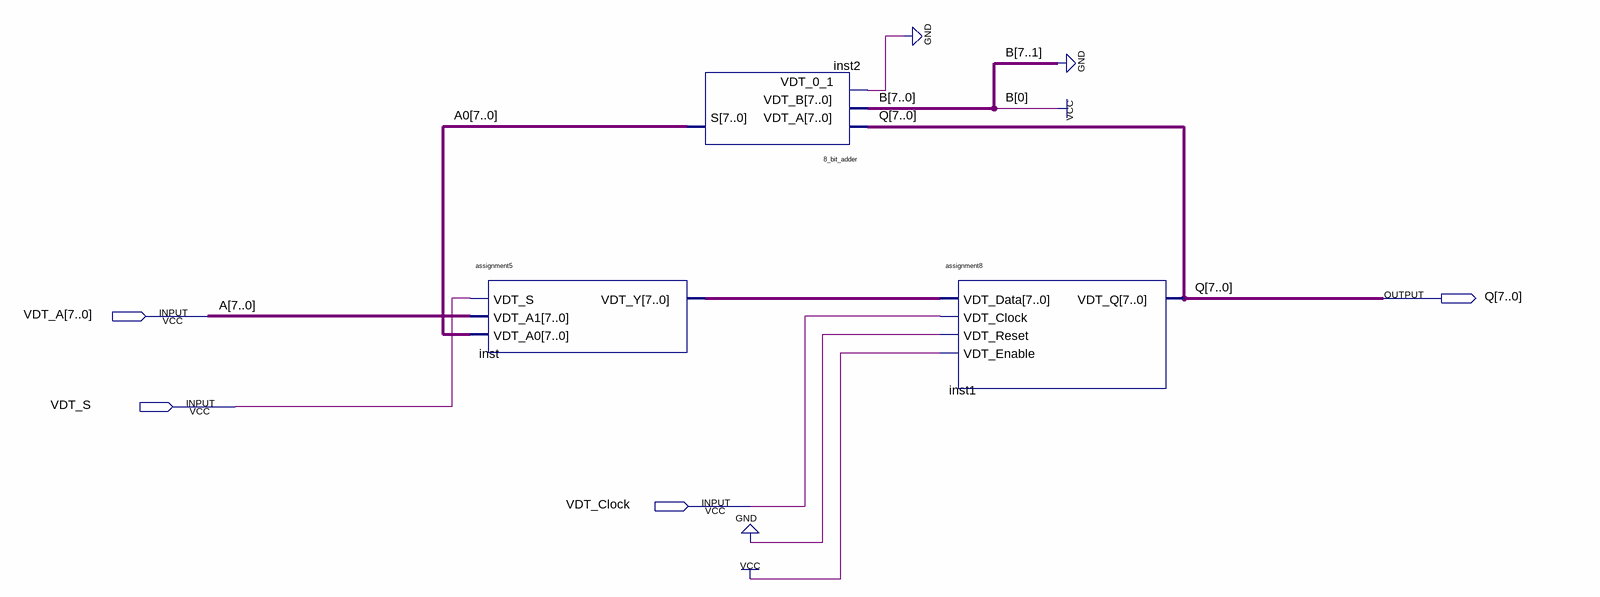
[diagram p0: schematic sheet]
// Quartus schematic assignment2.bdf as structural Verilog: 3 symbols, 4 pins
module assignment2 (
  input  [7:0] VDT_A,
  input  VDT_S,
  input  VDT_Clock,
  output [7:0] Q
);

  wire [7:0] A0, inst_vdt_y;

  assignment5 inst (.VDT_S(VDT_S), .VDT_A1(VDT_A), .VDT_A0(A0), .VDT_Y(inst_vdt_y));
  \8_bit_adder  inst2 (.VDT_A(Q), .VDT_B(8'b00000001), .VDT_0_1(1'b0), .S(A0));
  assignment8 inst1 (.VDT_Data(inst_vdt_y), .VDT_Clock(VDT_Clock), .VDT_Reset(1'b0), .VDT_Enable(1'b1), .VDT_Q(Q));

  // Other names for the same wires on the sheet: A[7:0] = VDT_A
endmodule
